# EAGLE design Stick of Joy (with headers) (EAGLE 9.2.1)
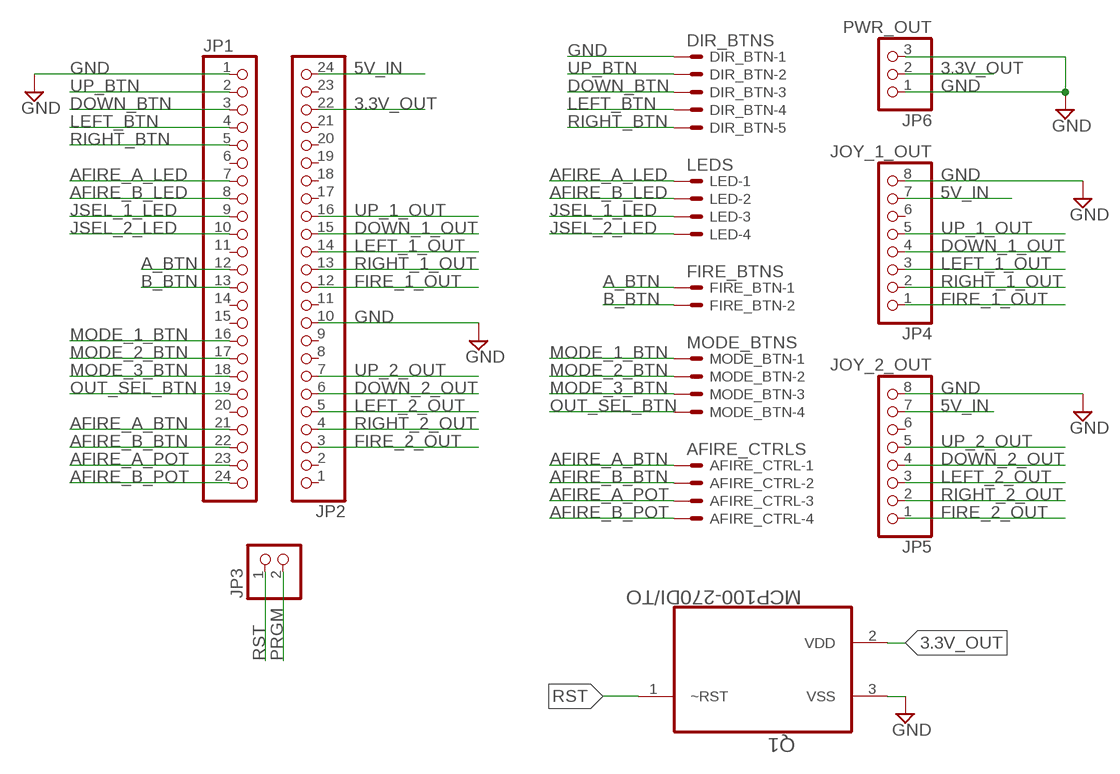
[diagram p0: schematic, sheet 1]

## Parts
AFIRE_CTRL  AFIRE_CTRLS  JST-XH-04-PIN-ROUND-PAD  [JST-XH-04-PACKAGE-ROUND-PAD]
DIR_BTN  DIR_BTNS  JST-XH-05-PIN-ROUND-PAD  [JST-XH-05-PACKAGE-ROUND-PAD]
FIRE_BTN  FIRE_BTNS  JST-XH-02-PIN-ROUND-PAD  [JST-XH-02-PACKAGE-ROUND-PAD]
JP1  PINHD-1X24  [1X24]
JP2  PINHD-1X24  [1X24]
JP3  PINHD-1X2  [1X02]
JP4  JOY_1_OUT  PINHD-1X8  [1X08]
JP5  JOY_2_OUT  PINHD-1X8  [1X08]
JP6  PWR_OUT  PINHD-1X3  [1X03]
LED  LEDS  JST-XH-04-PIN-ROUND-PAD  [JST-XH-04-PACKAGE-ROUND-PAD]
MODE_BTN  MODE_BTNS  JST-XH-04-PIN-ROUND-PAD  [JST-XH-04-PACKAGE-ROUND-PAD]
Q1  MCP100-270DI/TO  [TO127P254X495-3]

## Nets
3.3V_OUT: JP2.22 JP6.2 Q1.2(VDD)
5V_IN: JP2.24 JP4.7 JP5.7
A_BTN: FIRE_BTN.1 JP1.12
AFIRE_A_BTN: AFIRE_CTRL.1 JP1.21
AFIRE_A_LED: JP1.7 LED.1
AFIRE_A_POT: AFIRE_CTRL.3 JP1.23
AFIRE_B_BTN: AFIRE_CTRL.2 JP1.22
AFIRE_B_LED: JP1.8 LED.2
AFIRE_B_POT: AFIRE_CTRL.4 JP1.24
B_BTN: FIRE_BTN.2 JP1.13
DOWN_1_OUT: JP2.15 JP4.4
DOWN_2_OUT: JP2.6 JP5.4
DOWN_BTN: DIR_BTN.3 JP1.3
FIRE_1_OUT: JP2.12 JP4.1
FIRE_2_OUT: JP2.3 JP5.1
GND: DIR_BTN.1 JP1.1 JP2.10 JP4.8 JP5.8 JP6.1 JP6.3 Q1.3(VSS)
JSEL_1_LED: JP1.9 LED.3
JSEL_2_LED: JP1.10 LED.4
LEFT_1_OUT: JP2.14 JP4.3
LEFT_2_OUT: JP2.5 JP5.3
LEFT_BTN: DIR_BTN.4 JP1.4
MODE_1_BTN: JP1.16 MODE_BTN.1
MODE_2_BTN: JP1.17 MODE_BTN.2
MODE_3_BTN: JP1.18 MODE_BTN.3
OUT_SEL_BTN: JP1.19 MODE_BTN.4
PRGM: JP3.2
RIGHT_1_OUT: JP2.13 JP4.2
RIGHT_2_OUT: JP2.4 JP5.2
RIGHT_BTN: DIR_BTN.5 JP1.5
RST: JP3.1 Q1.1(~RST)
UP_1_OUT: JP2.16 JP4.5
UP_2_OUT: JP2.7 JP5.5
UP_BTN: DIR_BTN.2 JP1.2
Unconnected: JP1.6 JP1.11 JP1.14 JP1.15 JP1.20 JP2.1 JP2.2 JP2.8 JP2.9 JP2.11 JP2.17 JP2.18 JP2.19 JP2.20 JP2.21 JP2.23 JP4.6 JP5.6

## Library data of the parts
AFIRE_CTRL LED MODE_BTN = Rembrandt Electronics - JST XH Connectors v1-0:JST-XH-04-PIN: JST XH Connector 2 Pin Wire to board connector. Pitch: 2,54 mm, (0.100") Number of pins: 4 Created by Rembrandt Electronics www.rembrandtelectronics.com
DIR_BTN = Rembrandt Electronics - JST XH Connectors v1-0:JST-XH-05-PIN: JST XH Connector 2 Pin Wire to board connector. Pitch: 2,54 mm, (0.100") Number of pins: 5 Created by Rembrandt Electronics www.rembrandtelectronics.com
FIRE_BTN = Rembrandt Electronics - JST XH Connectors v1-0:JST-XH-02-PIN: JST XH Connector 2 Pin Wire to board connector. Pitch: 2,54 mm, (0.100") Number of pins: 2 Created by Rembrandt Electronics www.rembrandtelectronics.com
JP1 JP2 = pinhead:PINHD-1X24: PIN HEADER
JP3 = pinhead:PINHD-1X2: PIN HEADER
JP4 JP5 = pinhead:PINHD-1X8: PIN HEADER
JP6 = pinhead:PINHD-1X3: PIN HEADER
Q1 = MCP100-270DI_TO:MCP100-270DI/TO: SUPERVISORY CIRCUIT; DESCRIPTION: System Supervisors - Power Supply Monitors with Reset Generators Push-Pull Low; DIGI-KEY_PART_NUMBER: MCP100-270DI/TO-ND; DIGI-KEY_PURCHASE_URL: https://www.digikey.com/product-detail/en/microchip-technology/MCP100-270DI-TO/MCP100-270DI-TO-ND/275218?utm_source=snapeda&utm_medium=aggregator&utm_campaign=symbol; MF: Microchip; MP: MCP100-270DI/TO; PACKAGE: TO-92 Microchip

## Board
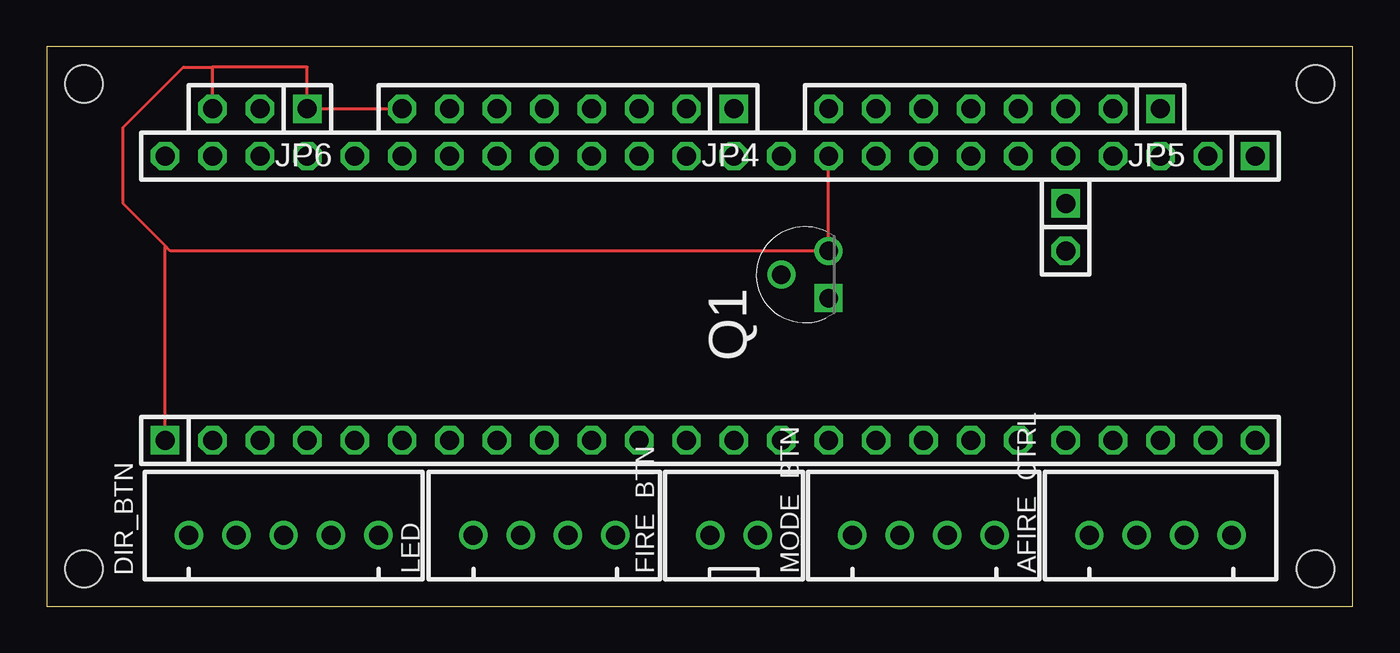
[diagram p1: board, top side]
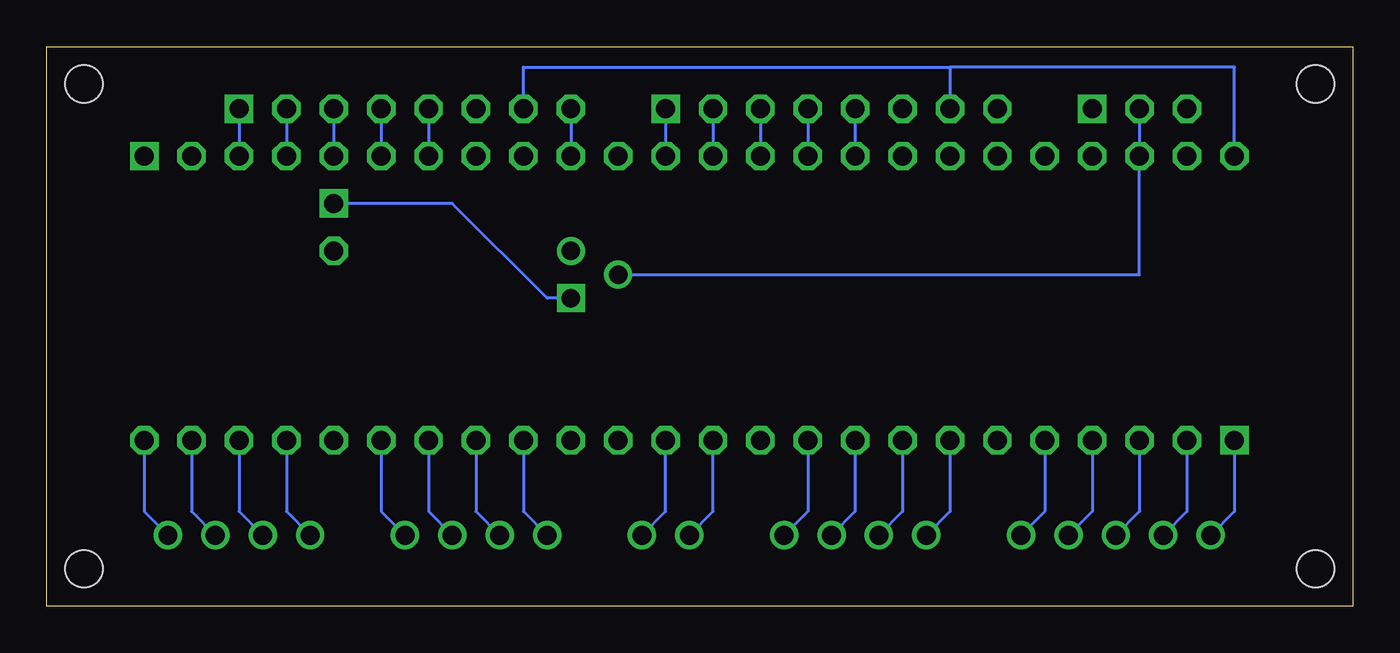
[diagram p2: board, bottom side, seen from below]

Size 70 x 30 mm. Coordinates in mm from the lower left corner, seen from the top.
Outline: 0,0 70,0 70,30 0,30 0,0
Copper layers (1*16): Top 0.035mm / dielectric 1.5mm / Bottom 0.035mm
Design rules "default": minimum track width 6mil, minimum drill 0.35mm, track to track 6mil, track to pad 6mil, pad to pad 6mil, via to via 6mil, smd to smd 6mil, copper to edge 40mil, drill to drill 6mil, minimum pad ring 10mil, minimum via ring 8mil, stop-mask expansion 4mil, vias tented up to drill 0mil, thermal gap 10mil
Holes 2 mm at 2,28 2,2 68,28 68,2

### Footprints (pad centres in the part's own frame; a part is rotated, then mirrored left to right if it is on the bottom)
JST-XH-04-PACKAGE-ROUND-PAD = drill 1.016: 1 -3.81,0; 2 -1.27,0; 3 1.27,0; 4 3.81,0
JST-XH-05-PACKAGE-ROUND-PAD = drill 1.016: 1 -5.08,0; 2 -2.54,0; 3 0,0; 4 2.54,0; 5 5.08,0
JST-XH-02-PACKAGE-ROUND-PAD = drill 1.016: 1 -1.27,0; 2 1.27,0
1X24 = drill 1.016 square: 1 -29.21,0 | drill 1.016 octagon: 2 -26.67,0; 3 -24.13,0; 4 -21.59,0; 5 -19.05,0; 6 -16.51,0; 7 -13.97,0; 8 -11.43,0; 9 -8.89,0; 10 -6.35,0; 11 -3.81,0; 12 -1.27,0; 13 1.27,0; 14 3.81,0; 15 6.35,0; 16 8.89,0; 17 11.43,0; 18 13.97,0; 19 16.51,0; 20 19.05,0; 21 21.59,0; 22 24.13,0; 23 26.67,0; 24 29.21,0
1X02 = drill 1.016 square: 1 -1.27,0 | drill 1.016 octagon: 2 1.27,0
1X08 = drill 1.016 square: 1 -8.89,0 | drill 1.016 octagon: 2 -6.35,0; 3 -3.81,0; 4 -1.27,0; 5 1.27,0; 6 3.81,0; 7 6.35,0; 8 8.89,0
1X03 = drill 1.016 square: 1 -2.54,0 | drill 1.016 octagon: 2 0,0; 3 2.54,0
TO127P254X495-3 = drill 0.991 square: 1 -2.54,-2.54 | drill 0.991: 2 -1.27,0; 3 0,-2.54

### Placement (x,y rotation side)
AFIRE_CTRL  59.69,3.81 0 top
DIR_BTN  12.7,3.81 0 top
FIRE_BTN  36.83,3.81 0 top
JP1  35.56,8.89 0 top
JP2  35.56,24.13 180 top
JP3  54.61,20.32 270 top
JP4  27.94,26.67 180 top
JP5  50.8,26.67 180 top
JP6  11.43,26.67 180 top
LED  26.67,3.81 0 top
MODE_BTN  46.99,3.81 0 top
Q1  39.37,19.05 90 top

### Tracks (layer width: path | path; a pad name or v marks a point on that pad's centre or on a via)
3.3V_OUT
  Bottom 0.152: Q1.2 11.43,17.78 JP2.22 JP6.2
5V_IN
  Bottom 0.152: JP2.24 6.35,28.91 21.59,28.91 | 21.59,28.91 JP4.7 | JP5.7 44.45,28.91 21.59,28.91
A_BTN
  Bottom 0.152: JP1.12 34.29,5.08 FIRE_BTN.1
AFIRE_A_BTN
  Bottom 0.152: JP1.21 57.15,5.08 AFIRE_CTRL.1
AFIRE_A_LED
  Bottom 0.152: JP1.7 21.59,5.08 LED.1
AFIRE_A_POT
  Bottom 0.152: JP1.23 62.23,5.08 AFIRE_CTRL.3
AFIRE_B_BTN
  Bottom 0.152: JP1.22 59.69,5.08 AFIRE_CTRL.2
AFIRE_B_LED
  Bottom 0.152: JP1.8 24.13,5.08 LED.2
AFIRE_B_POT
  Bottom 0.152: JP1.24 64.77,5.08 AFIRE_CTRL.4
B_BTN
  Bottom 0.152: JP1.13 36.83,5.08 FIRE_BTN.2
DOWN_1_OUT
  Bottom 0.152: JP4.4 JP2.15
DOWN_2_OUT
  Bottom 0.152: JP5.4 JP2.6
DOWN_BTN
  Bottom 0.152: JP1.3 11.43,5.08 DIR_BTN.3
FIRE_1_OUT
  Bottom 0.152: JP4.1 JP2.12
FIRE_2_OUT
  Bottom 0.152: JP5.1 JP2.3
GND
  Top 0.152: 6.35,19.33 6.63,19.05 Q1.3 JP2.10 | 6.35,19.33 4.09,21.59 4.09,25.68 7.32,28.91 8.89,28.91 | JP6.3 8.89,28.91 | 8.89,28.91 13.97,28.91 JP6.1 JP4.8 | JP1.1 6.35,19.33
  Bottom 0.152: JP1.1 6.35,5.08 DIR_BTN.1 | JP5.8 JP2.10
JSEL_1_LED
  Bottom 0.152: JP1.9 26.67,5.08 LED.3
JSEL_2_LED
  Bottom 0.152: JP1.10 29.21,5.08 LED.4
LEFT_1_OUT
  Bottom 0.152: JP4.3 JP2.14
LEFT_2_OUT
  Bottom 0.152: JP5.3 JP2.5
LEFT_BTN
  Bottom 0.152: JP1.4 13.97,5.08 DIR_BTN.4
MODE_1_BTN
  Bottom 0.152: JP1.16 44.45,5.08 MODE_BTN.1
MODE_2_BTN
  Bottom 0.152: JP1.17 46.99,5.08 MODE_BTN.2
MODE_3_BTN
  Bottom 0.152: JP1.18 49.53,5.08 MODE_BTN.3
OUT_SEL_BTN
  Bottom 0.152: JP1.19 52.07,5.08 MODE_BTN.4
RIGHT_1_OUT
  Bottom 0.152: JP4.2 JP2.13
RIGHT_2_OUT
  Bottom 0.152: JP5.2 JP2.4
RIGHT_BTN
  Bottom 0.152: JP1.5 16.51,5.08 DIR_BTN.5
RST
  Bottom 0.152: Q1.1 43.18,16.51 48.26,21.59 JP3.1
UP_1_OUT
  Bottom 0.152: JP4.5 JP2.16
UP_2_OUT
  Bottom 0.152: JP5.5 JP2.7
UP_BTN
  Bottom 0.152: JP1.2 8.89,5.08 DIR_BTN.2